# EAGLE design ub (EAGLE 5.11)
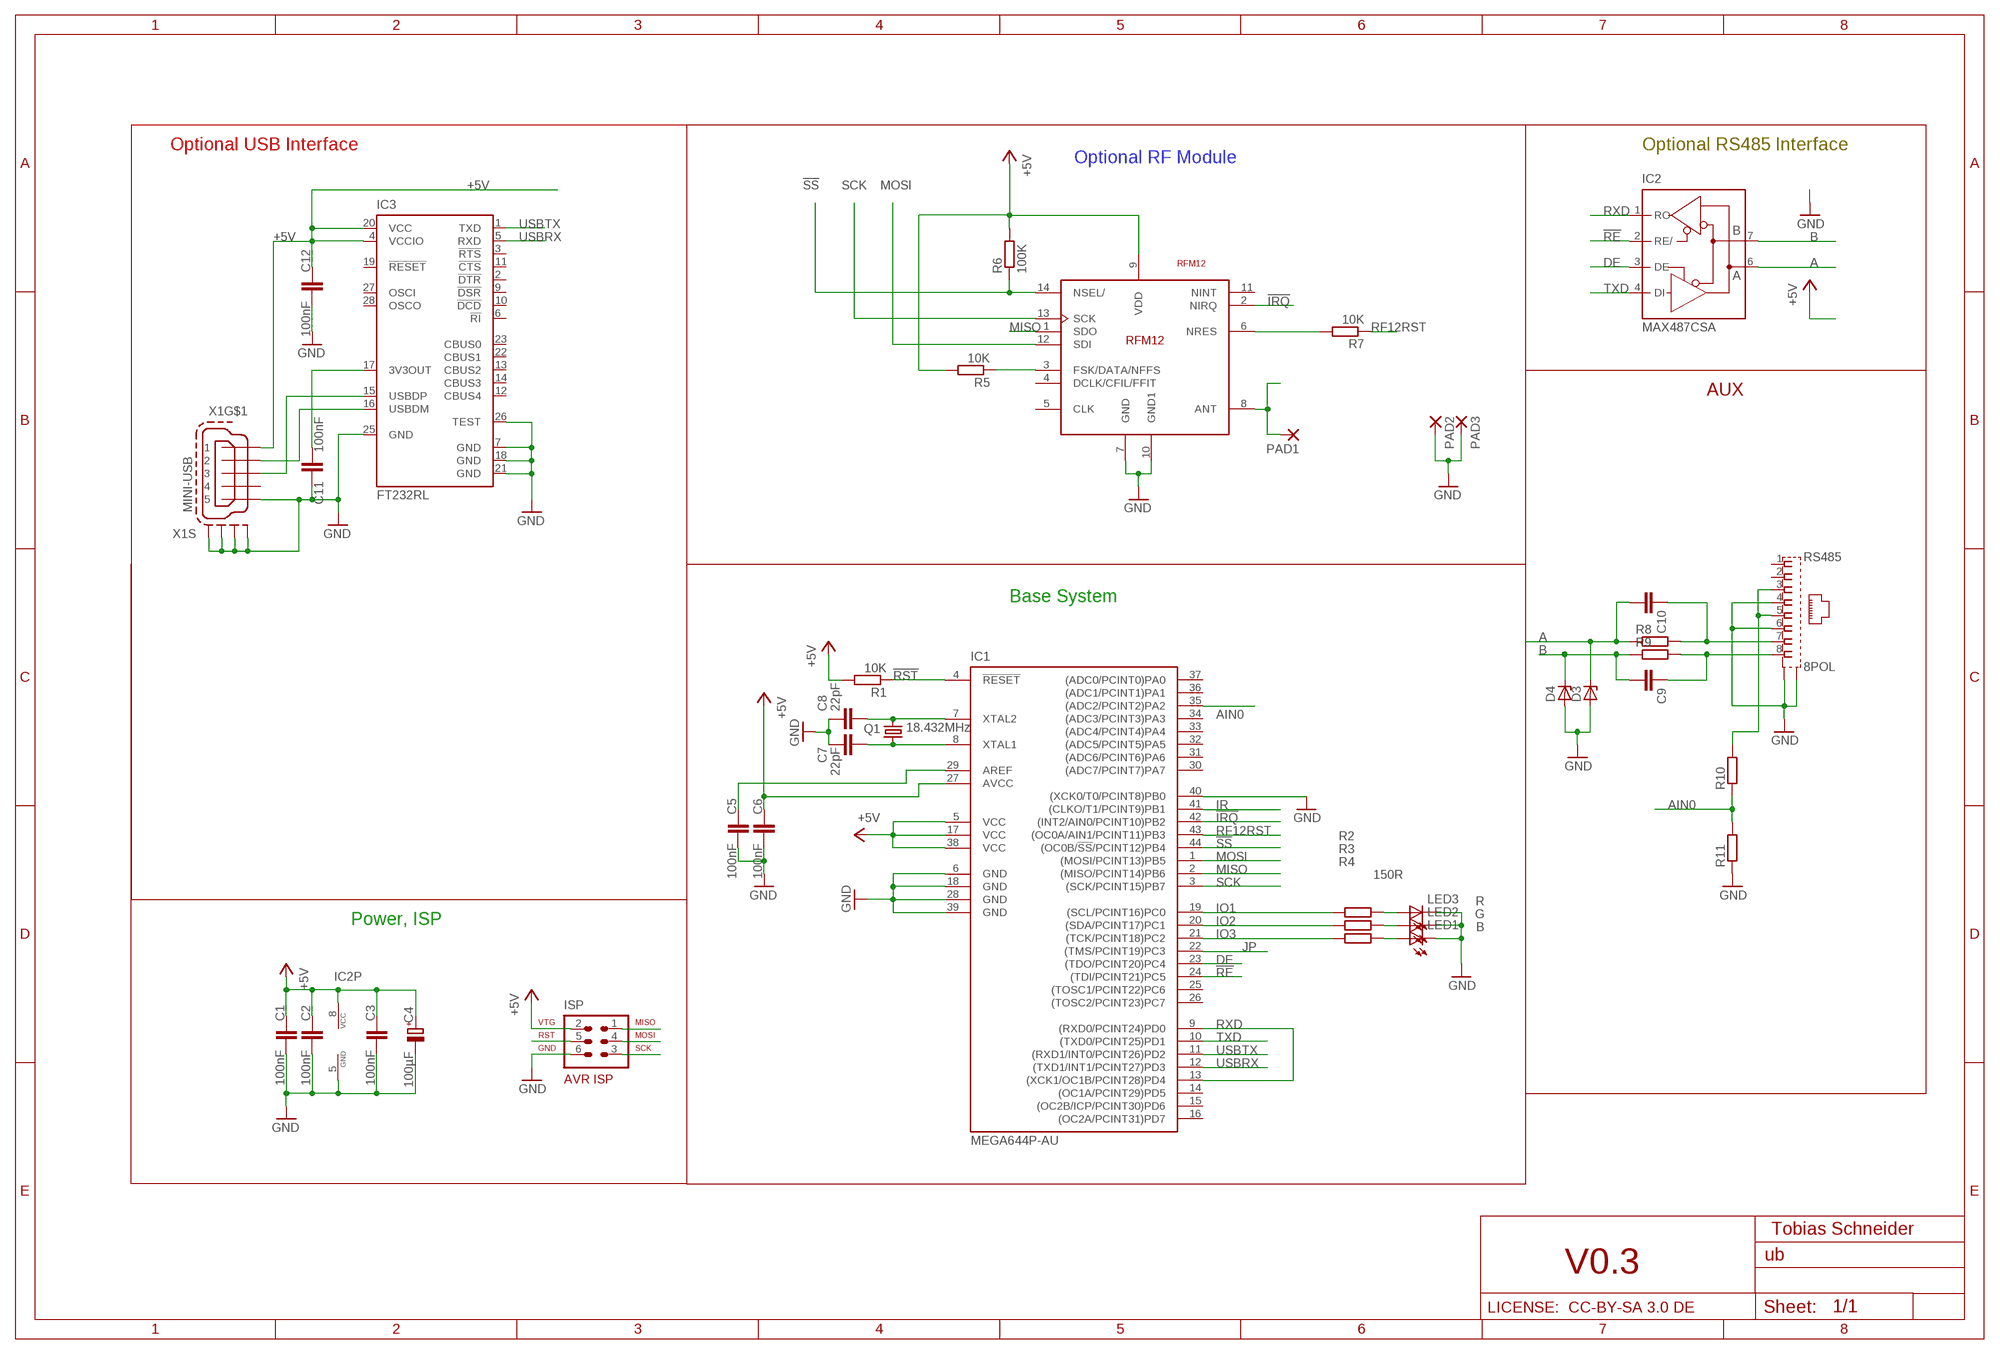
[diagram p0: schematic, sheet 1]

## Parts
C1  100nF  C-EUC0805K  [C0805K]
C2  100nF  C-EUC0805K  [C0805K]
C3  100nF  C-EUC0805K  [C0805K]
C4  100µF  CPOL-EUE2.5-6  [E2,5-6]
C5  100nF  C-EUC0805K  [C0805K]
C6  100nF  C-EUC0805K  [C0805K]
C7  22pF  C-EUC0805K  [C0805K]
C8  22pF  C-EUC0805K  [C0805K]
C9  C-EUC0805K  [C0805K]
C10  C-EUC0805K  [C0805K]
C11  100nF  C-EUC0805K  [C0805K]
C12  100nF  C-EUC0805K  [C0805K]
D3  ZENER-DIODESOD80C  [SOD80C]
D4  ZENER-DIODESOD80C  [SOD80C]
IC1  MEGA644P-AU  MEGA164P/324P/644P-AU  [TQFP44]
IC2  MAX487CSA  MAX481CSA  [SO08]
IC3  FT232RL  [SSOP28]
ISP  AVR-ISP-6  [AVR-ISP-6]
LED1  B  LEDCHIP-LED0805  [CHIP-LED0805]
LED2  G  LEDCHIP-LED0805  [CHIP-LED0805]
LED3  R  LEDCHIP-LED0805  [CHIP-LED0805]
PAD1  SMD2  [SMD1,27-2,54]
PAD2  SMD2  [SMD1,27-2,54]
PAD3  SMD2  [SMD1,27-2,54]
Q1  18.432MHz  CRYTALHC49UP  [HC49UP@1]
R1  10K  R-EU_M0805  [M0805]
R2  150R  R-EU_R0805  [R0805]
R3  150R  R-EU_R0805  [R0805]
R4  150R  R-EU_R0805  [R0805]
R5  10K  R-EU_M0805  [M0805]
R6  100K  R-EU_M0805  [M0805]
R7  10K  R-EU_M0805  [M0805]
R8  R-EU_R0805  [R0805]
R9  R-EU_R0805  [R0805]
R10  R-EU_R0805  [R0805]
R11  R-EU_R0805  [R0805]
RFM12  RFM12  FRM12  [RFM12]
RS485  8POL  [8POL]
X1  MINI-USB  MINI-USB-SCHIELD-32005-201  [32005-201]

## Nets
!IRQ: IC1.42((INT2/AIN0/PCINT10)PB2) RFM12.2(NIRQ)
!RE: IC1.24((TDI/PCINT21)PC5) IC2.2(RE/)
!RST: IC1.4(!RESET) ISP.5 R1.1
!SS: IC1.44((OC0B/!SS!/PCINT12)PB4) R6.1 RFM12.14(NSEL/)
+5V: C1.1 C2.1 C3.1 C4.+ C6.1 C12.1 IC1.5(VCC) IC1.17(VCC) IC1.27(AVCC) IC1.38(VCC) IC2.8(VCC) IC3.4(VCCIO) IC3.20(VCC) ISP.2 R1.2 R5.2 R6.2 RFM12.9(VDD) X1.1
A: C10.2 D3.C IC2.6(A) R8.1
AIN0: IC1.35((ADC2/PCINT2)PA2) R10.1 R11.2
B: C9.2 D4.C IC2.7(B) R9.1
DE: IC1.23((TDO/PCINT20)PC4) IC2.3(DE)
GND: C1.2 C2.2 C3.2 C4.- C5.2 C6.2 C7.1 C8.1 C11.1 C12.2 D3.A D4.A IC1.6(GND) IC1.18(GND) IC1.28(GND) IC1.39(GND) IC1.40((XCK0/T0/PCINT8)PB0) IC2.5(GND) IC3.7(GND) IC3.18(GND) IC3.21(GND) IC3.25(GND) IC3.26(TEST) ISP.6 LED1.C LED2.C LED3.C PAD2.1(P) PAD3.1(P) R11.1 RFM12.7(GND) RFM12.10(GND1) RS485.4 RS485.6 RS485.S1 RS485.S2 X1.5 X1.M1(S:S1) X1.M2(S:S2) X1.M3(S:S3) X1.M4(S:S4)
IO1: IC1.19((SCL/PCINT16)PC0) R2.2
IO2: IC1.20((SDA/PCINT17)PC1) R3.2
IO3: IC1.21((TCK/PCINT18)PC2) R4.2
IR: IC1.41((CLKO/T1/PCINT9)PB1)
JP: IC1.22((TMS/PCINT19)PC3)
MISO: IC1.2((MISO/PCINT14)PB6) ISP.1 RFM12.1(SDO)
MOSI: IC1.1((MOSI/PCINT13)PB5) ISP.4 RFM12.12(SDI)
N$3: C9.1 R9.2 RS485.8
N$10: IC3.16(USBDM) X1.2
N$11: R5.1 RFM12.3(FSK/DATA/NFFS)
N$12: R7.2 RFM12.6(NRES)
N$13: PAD1.1(P) RFM12.8(ANT)
N$15: C10.1 R8.2 RS485.7
N$16: IC3.15(USBDP) X1.3
N$20: C11.2 IC3.17(3V3OUT)
N$21: LED1.A R4.1
N$22: LED2.A R3.1
N$23: LED3.A R2.1
N$29: C5.1 IC1.29(AREF)
RF12RST: IC1.43((OC0A/AIN1/PCINT11)PB3) R7.1
RXD: IC1.9((RXD0/PCINT24)PD0) IC1.13((XCK1/OC1B/PCINT28)PD4) IC2.1(RO)
SCK: IC1.3((SCK/PCINT15)PB7) ISP.3 RFM12.13(SCK)
TXD: IC1.10((TXD0/PCINT25)PD1) IC2.4(DI)
USBRX: IC1.12((TXD1/INT1/PCINT27)PD3) IC3.5(RXD)
USBTX: IC1.11((RXD1/INT0/PCINT26)PD2) IC3.1(TXD)
VIN: R10.2 RS485.3 RS485.5
XTAL1: C8.2 IC1.7(XTAL2) Q1.2
XTAL2: C7.2 IC1.8(XTAL1) Q1.1
Unconnected: IC1.14((OC1A/PCINT29)PD5) IC1.15((OC2B/ICP/PCINT30)PD6) IC1.16((OC2A/PCINT31)PD7) IC1.25((TOSC1/PCINT22)PC6) IC1.26((TOSC2/PCINT23)PC7) IC1.30((ADC7/PCINT7)PA7) IC1.31((ADC6/PCINT6)PA6) IC1.32((ADC5/PCINT5)PA5) IC1.33((ADC4/PCINT4)PA4) IC1.34((ADC3/PCINT3)PA3) IC1.36((ADC1/PCINT1)PA1) IC1.37((ADC0/PCINT0)PA0) IC3.2(!DTR) IC3.3(!RTS) IC3.6(!RI) IC3.9(!DSR) IC3.10(!DCD) IC3.11(!CTS) IC3.12(CBUS4) IC3.13(CBUS2) IC3.14(CBUS3) IC3.19(!RESET) IC3.22(CBUS1) IC3.23(CBUS0) IC3.27(OSCI) IC3.28(OSCO) RFM12.4(DCLK/CFIL/FFIT) RFM12.5(CLK) RFM12.11(NINT) RS485.1 RS485.2 X1.4

## Notes on the sheet
- Optional USB Interface | Optional RS485 Interface
- Optional RF Module
- AUX
- Base System
- Power, ISP
- Tobias Schneider
- V0.3
- LICENSE:  CC-BY-SA 3.0 DE

## Library data of the parts
C1-C3 C5-C12 = rcl:C-EU: CAPACITOR, European symbol
C4 = rcl:CPOL-EU: POLARIZED CAPACITOR, European symbol
D3 D4 = diode:ZENER-DIODE: Z-Diode
IC1 = avr-5:MEGA164P/324P/644P-AU
IC2 = maxim:MAX481CSA: RS485 TRANSEIVER
IC3 = ftdichip:FT232R: Source: http://www.ftdichip.com/Documents/DataSheets/DS_FT232R_v104.pdf
ISP = atmel:AVR-ISP-6: AVR ISP-6 Serial Programming Header
LED1-LED3 = led:LED: LED OSRAM: - CHIPLED LG R971, LG N971, LY N971, LG Q971, LY Q971, LO R971, LY R971 LH N974, LH R974 LS Q976, LO Q976, LY Q976 LO Q996 - Hyper CHIPLED LW Q18S LB Q993, LB Q99A, LB R99A - SideLED LS A670, LO A670, LY A670, LG A670, LP A670 LB A673, LV A673, LT A673, LW A673 LH A674 LY A675 LS A676, LA A676, LO A676, LY A676, LW A676 LS A679, LY A679, LG A679 - Hyper Micro SIDELED® LS Y876, LA Y876, LO Y876, LY Y876 LT Y87S - SmartLED LW L88C, LW L88S LB L89C, LB L89S, LG L890 LS L89K, LO L89K, LY L89K LS L896, LA L896, LO L896, LY L896 - TOPLED LS T670, LO T670, LY T670, LG T670, LP T670 LSG T670, LSP T670, LSY T670, LOP T670, LYG T670 LG T671, LOG T671, LSG T671 LB T673, LV T673, LT T673, LW T673 LH T674 LS T676, LA T676, LO T676, LY T676, LB T676, LH T676, LSB T676, LW T676 LB T67C, LV T67C, LT T67C, LS T67K, LO T67K, LY T67K, LW E67C LS E67B, LA E67B, LO E67B, LY E67B, LB E67C, LV E67C, LT E67C LW T67C LS T679, LY T679, LG T679 LS T770, LO T770, LY T770, LG T770, LP T770 LB T773, LV T773, LT T773, LW T773 LH T774 LS E675, LA E675, LY E675, LS T675 LS T776, LA T776, LO T776, LY T776, LB T776 LHGB T686 LT T68C, LB T68C - Hyper Mini TOPLED® LB M676 - Mini TOPLED Santana® LG M470 LS M47K, LO M47K, LY M47K Source: http://www.osram.convergy.de LUXEON: - LUMILED® LXK2-PW12-R00, LXK2-PW12-S00, LXK2-PW14-U00, LXK2-PW14-V00 LXK2-PM12-R00, LXK2-PM12-S00, LXK2-PM14-U00 LXK2-PE12-Q00, LXK2-PE12-R00, LXK2-PE12-S00, LXK2-PE14-T00, LXK2-PE14-U00 LXK2-PB12-K00, LXK2-PB12-L00, LXK2-PB12-M00, LXK2-PB14-N00, LXK2-PB14-P00, LXK2-PB14-Q00 LXK2-PR12-L00, LXK2-PR12-M00, LXK2-PR14-Q00, LXK2-PR14-R00 LXK2-PD12-Q00, LXK2-PD12-R00, LXK2-PD12-S00 LXK2-PH12-R00, LXK2-PH12-S00 LXK2-PL12-P00, LXK2-PL12-Q00, LXK2-PL12-R00 Source: www.luxeon.com KINGBRIGHT: KA-3528ASYC Source: www.kingbright.com
PAD1-PAD3 = wirepad:SMD2: SMD PAD
Q1 = crystal:CRYTAL: CRYSTAL
R1-R11 = rcl:R-EU_: RESISTOR, European symbol
RFM12 = RFM12:FRM12
RS485 = con-amp:8POL
X1 = con-cypressindustries:MINI-USB-SCHIELD-: MINI USB-B Conector Source: www.cypressindustries.com

## Board
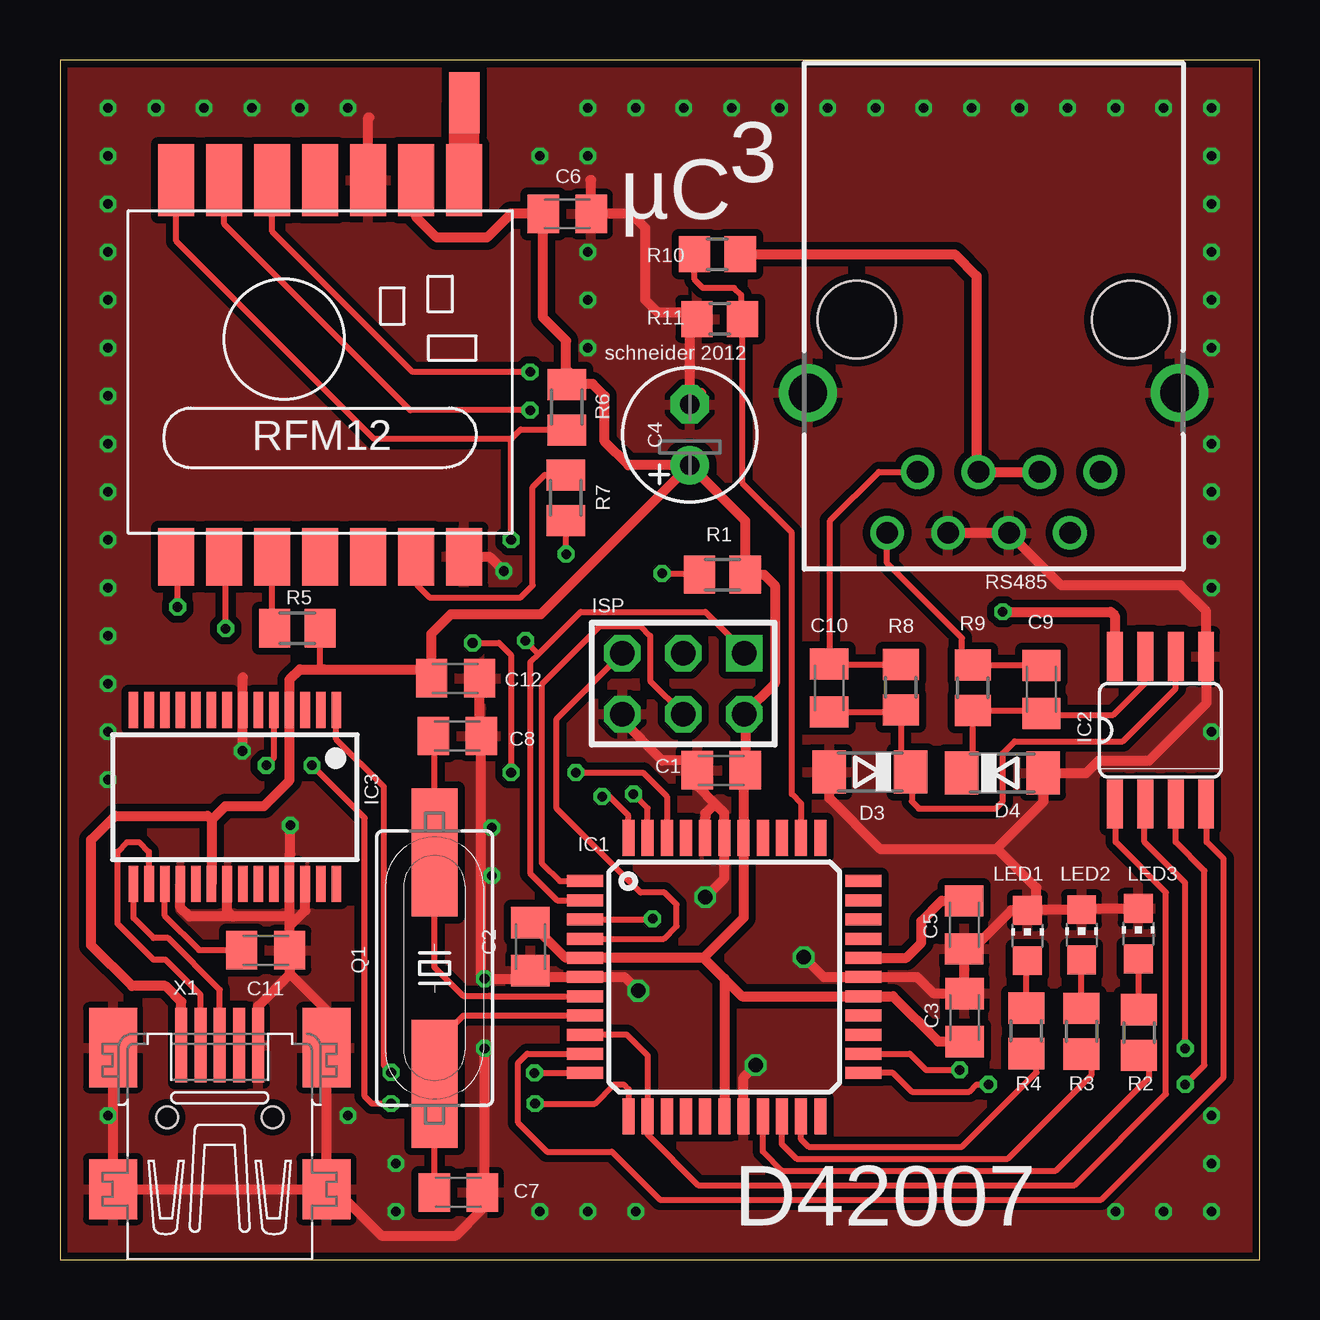
[diagram p1: board, top side]
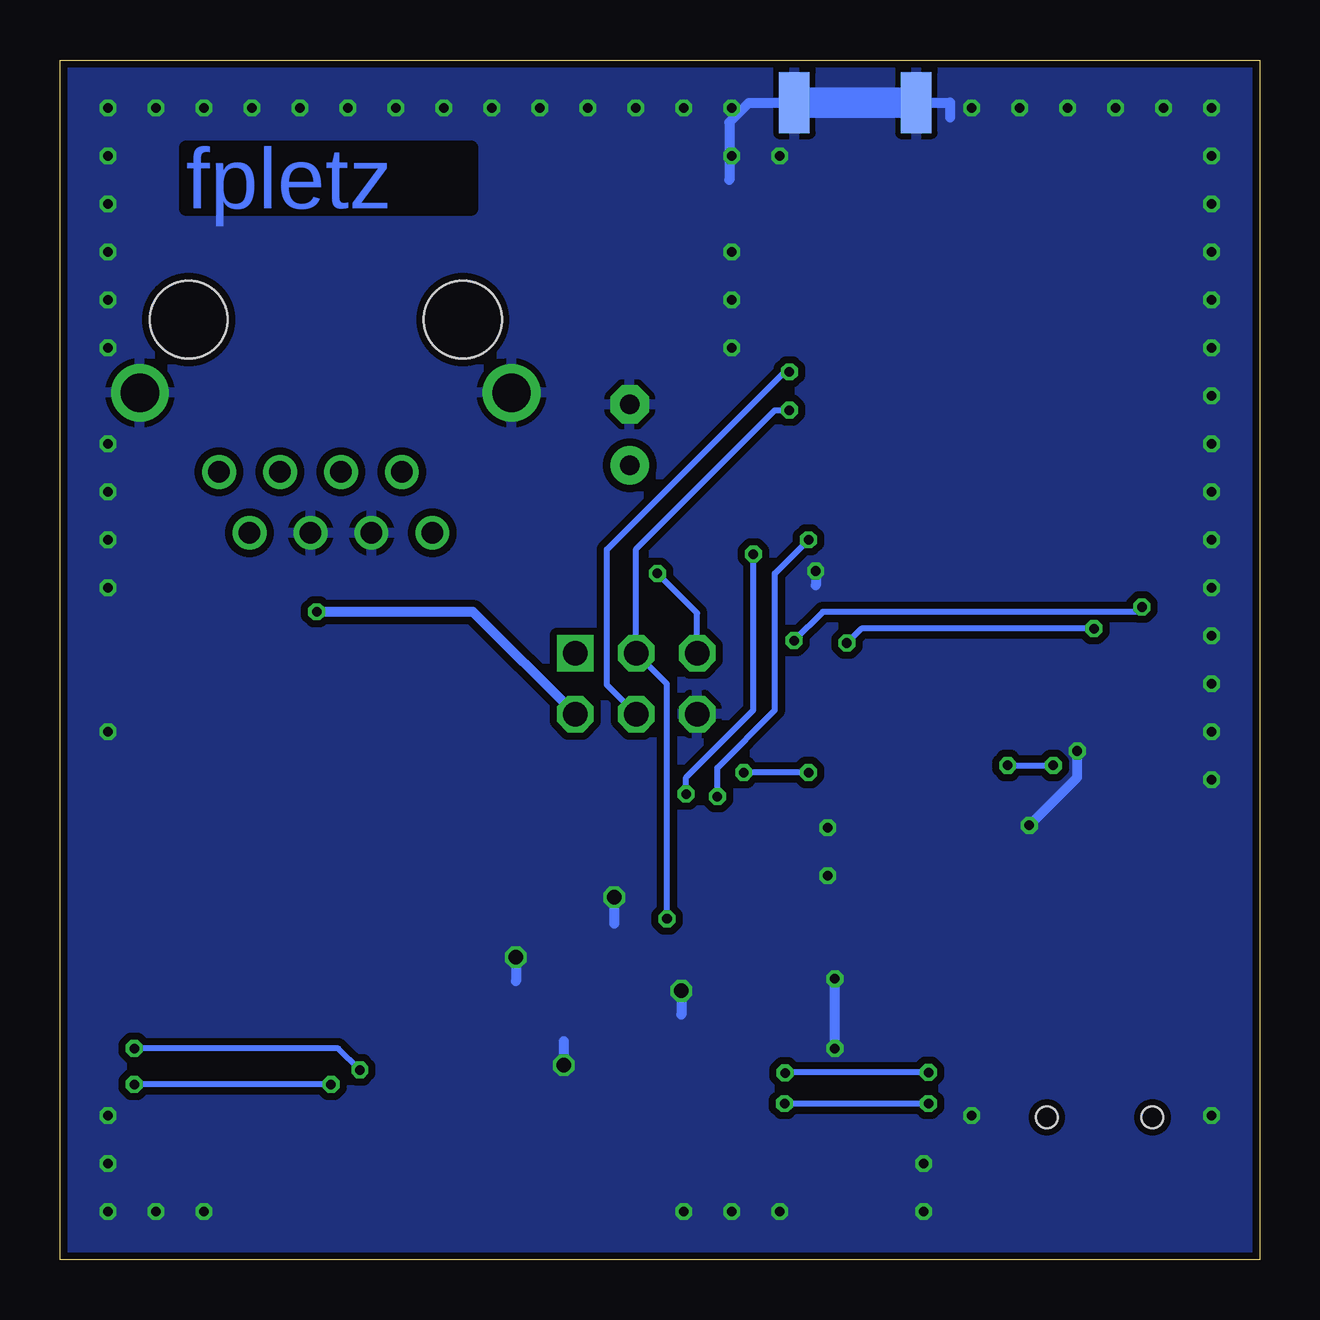
[diagram p2: board, bottom side, seen from below]

Size 50 x 50 mm. Coordinates in mm from the lower left corner, seen from the top.
Outline: 0,0 50,0 50,50 0,50 0,0
Copper layers (1*16): Top 0.035mm / dielectric 1.5mm / Bottom 0.035mm
Design rules "Fusion_eagle_rule_v1.1 *": minimum track width 6mil, minimum drill 12mil, track to track 6mil, track to pad 6mil, pad to pad 6mil, via to via 6mil, smd to smd 0mil, copper to edge 10mil, drill to drill 10mil, minimum pad ring 10mil, minimum via ring 6mil, stop-mask expansion 2mil, vias tented up to drill 100mil, thermal gap 10mil
tRestrict: area 9.9,14.9 to 9.9,16.5; area 27.2,16.9 to 27.2,18.3; area 27.2,16.9 to 27.4,18.3

### Footprints (pad centres in the part's own frame; a part is rotated, then mirrored left to right if it is on the bottom)
C0805K = smd 1.3 x 1.6: 1 -1,0; 2 1,0
E2,5-6 = drill 0.813 pad 1.6 round: + -1.27,0 | drill 0.813 pad 1.6 octagon: - 1.27,0
SOD80C = smd 1.4 x 1.8: A 1.7,0; C -1.7,0
TQFP44 = smd 1.5 x 0.5: 1 -5.8,4; 2 -5.8,3.2; 3 -5.8,2.4; 4 -5.8,1.6; 5 -5.8,0.8; 6 -5.8,0; 7 -5.8,-0.8; 8 -5.8,-1.6; 9 -5.8,-2.4; 10 -5.8,-3.2; 11 -5.8,-4; 23 5.8,-4; 24 5.8,-3.2; 25 5.8,-2.4; 26 5.8,-1.6; 27 5.8,-0.8; 28 5.8,0; 29 5.8,0.8; 30 5.8,1.6; 31 5.8,2.4; 32 5.8,3.2; 33 5.8,4 | smd 0.5 x 1.5: 12 -4,-5.8; 13 -3.2,-5.8; 14 -2.4,-5.8; 15 -1.6,-5.8; 16 -0.8,-5.8; 17 0,-5.8; 18 0.8,-5.8; 19 1.6,-5.8; 20 2.4,-5.8; 21 3.2,-5.8; 22 4,-5.8; 34 4,5.8; 35 3.2,5.8; 36 2.4,5.8; 37 1.6,5.8; 38 0.8,5.8; 39 0,5.8; 40 -0.8,5.8; 41 -1.6,5.8; 42 -2.4,5.8; 43 -3.2,5.8; 44 -4,5.8
SO08 = smd 0.66 x 2.032: 1 -1.905,-3.073; 2 -0.635,-3.073; 3 0.635,-3.073; 4 1.905,-3.073; 5 1.905,3.073; 6 0.635,3.073; 7 -0.635,3.073; 8 -1.905,3.073
SSOP28 = smd 0.4 x 1.5: 1 -4.225,-3.625; 2 -3.575,-3.625; 3 -2.925,-3.625; 4 -2.275,-3.625; 5 -1.625,-3.625; 6 -0.975,-3.625; 7 -0.325,-3.625; 8 0.325,-3.625; 9 0.975,-3.625; 10 1.625,-3.625; 11 2.275,-3.625; 12 2.925,-3.625; 13 3.575,-3.625; 14 4.225,-3.625; 15 4.225,3.625; 16 3.575,3.625; 17 2.925,3.625; 18 2.275,3.625; 19 1.625,3.625; 20 0.975,3.625; 21 0.325,3.625; 22 -0.325,3.625; 23 -0.975,3.625; 24 -1.625,3.625; 25 -2.275,3.625; 26 -2.925,3.625; 27 -3.575,3.625; 28 -4.225,3.625
AVR-ISP-6 = drill 1.016 square: 1 -2.54,-1.27 | drill 1.016 octagon: 2 -2.54,1.27; 3 0,-1.27; 4 0,1.27; 5 2.54,-1.27; 6 2.54,1.27
CHIP-LED0805 = smd 1.2 x 1.2: A 0,-1.05; C 0,1.05
SMD1,27-2,54 = smd 1.27 x 2.54: 1 0,0
HC49UP@1 = smd 5.334 x 1.93: 1 -4.826,0; 2 4.826,0
M0805 = smd 1.3 x 1.6: 1 -0.95,0; 2 0.95,0
R0805 = smd 1.3 x 1.5: 1 -0.95,0; 2 0.95,0
RFM12 = smd 1.5 x 2.4: 1 -5,-9.7; 2 -3,-9.7; 3 -1,-9.7; 4 1,-9.7; 5 3,-9.7; 6 5,-9.7; 7 7,-9.7 | smd 1.5 x 3: 8 7,6; 9 5,6; 10 3,6; 11 1,6; 12 -1,6; 13 -3,6; 14 -5,6
8POL = drill 0.9 round: 1 -4.445,6.35; 2 -3.175,8.89; 3 -1.905,6.35; 4 -0.635,8.89; 5 0.635,6.35; 6 1.905,8.89; 7 3.175,6.35; 8 4.445,8.89 | drill 1.6 round: S1 -7.745,3.05; S2 7.745,3.05 | hole 3.25: -5.715,0; 5.715,0
32005-201 = smd 3.1 x 0.5: 1 3,1.6; 2 3,0.8; 3 3,0; 4 3,-0.8; 5 3,-1.6 | smd 2.5 x 2: M1 -3,-4.45; M2 -3,4.45 | smd 3.3 x 2: M3 2.9,4.45; M4 2.9,-4.45 | hole 0.9: 0,2.2; 0,-2.2

### Placement (x,y rotation side)
C1  27.57,20.39 180 top
C2  19.61,13.04 270 top
C3  37.71,10.09 90 top
C4  26.25,34.37 90 top
C5  37.69,13.95 270 top
C6  21.14,43.59 0 top
C7  16.61,2.8 180 top
C8  16.56,21.82 180 top
C9  40.91,23.76 270 top
C10  32.07,23.82 270 top
C11  8.58,12.89 180 top
C12  16.49,24.22 0 top
D3  33.76,20.32 180 top
D4  39.28,20.28 0 top
IC1  27.69,11.78 0 top
IC2  45.87,22.06 0 top
IC3  7.29,19.27 180 top
ISP  25.98,24.01 180 top
LED1  40.33,13.51 0 top
LED2  42.59,13.54 0 top
LED3  44.94,13.58 0 top
PAD1  16.85,48.22 0 top
PAD2  14.31,48.22 0 bottom
PAD3  19.39,48.22 180 bottom
Q1  15.61,12.15 90 top
R1  27.61,28.55 0 top
R2  44.98,9.46 270 top
R3  42.57,9.51 270 top
R4  40.27,9.53 270 top
R5  9.9,26.31 0 top
R6  21.13,35.52 90 top
R7  21.08,31.75 90 top
R8  35.05,23.86 90 top
R9  38.05,23.84 90 top
R10  27.4,41.9 0 top
R11  27.5,39.2 0 top
RFM12  9.85,39 0 top
RS485  38.92,39.18 180 top
X1  6.66,5.93 90 top

### Tracks (layer width: path | path; a pad name or v marks a point on that pad's centre or on a via)
!IRQ  (via drill 0.4)
  Top 0.254: RFM12.2 6.9,29.25 v6.9,26.3 | IC1.42 25.3,19.3 24.3,20.3 v21.5,20.3 | v17.2,25.7 18.3,25.7 18.8,25.2 v18.8,20.3
  Bottom 0.254: v6.9,26.3 16.6,26.3 v17.2,25.7 | v18.8,20.3 v21.5,20.3
!RE  (via drill 0.4)
  Top 0.254: IC2.2 45.2,18.95 45.2,17.4 46.9,15.7 v46.9,8.8 | IC1.24 35.42,8.57 36.1,7.9 v37.5,7.9
  Bottom 0.254: v37.5,7.9 38.4,8.8 v46.9,8.8
!RST  (via drill 0.4)
  Top 0.254: IC1.4 25.18,13.38 25.7,13.9 25.7,14.8 25.2,15.3 24.2,15.3 23.1,16.4 22.7,16.8 20.7,18.8 20.7,22.54 ISP.5 | v25.1,28.6 26.61,28.6 R1.1
  Bottom 0.254: ISP.5 23.44,26.94 v25.1,28.6
!SS  (via drill 0.4)
  Top 0.254: 4.88,45.02 RFM12.14 4.85,42.45 13.1,34.2 18.8,34.2 | IC1.44 23.69,18.51 22.9,19.3 v22.6,19.3 | v18.8,30 18.8,34.2 | 18.8,34.2 19.2,34.6 21.11,34.6 R6.1
  Bottom 0.254: v18.8,30 20.2,28.6 20.2,22.9 22.6,20.5 v22.6,19.3
+5V  (via drill 0.4)
  Top 0.254: R5.2 10.85,24.75 11,24.6 | RFM12.9 14.8,45.05
  Top 0.406: C3.1 36.61,9.09 34.73,10.97 IC1.27 28.43,10.97 27.7,11.7 | IC1.17 27.7,11.7 | 26.82,12.57 IC1.5 21.07,12.57 C2.1 | 26.82,12.57 27.7,11.7 | 26.82,12.57 28.49,14.24 IC1.38 28.49,20.32 C1.1 28.57,22.69 ISP.2 29.8,24.02 29.8,28.1 29.35,28.55 R1.2 28.56,30.79 C4.+ | X1.1 5.06,10.74 4.4,11.4 3,11.4 1.3,13.1 1.3,17.5 2.3,18.5 6.14,18.5 6.32,18.32 | 6.32,18.32 IC3.20 | 6.32,18.32 6.9,18.9 8.5,18.9 9.57,19.97 IC3.4 9.57,24.17 10,24.6 11,24.6 15.11,24.6 C12.1 15.49,26.09 16.3,26.9 20.05,26.9 C4.+ | RFM12.9 14.85,43.45 15.7,42.6 17.8,42.6 18.8,43.6 C6.1 20.14,39.26 21.1,38.3 21.1,37.1 R6.2 | C4.+ 23.7,33.1 22.7,34.1 22.7,36 22.2,36.5 21.16,36.5 R6.2 | R6.2 21.2,37 | IC2.8 43.96,26.84 43.8,27 v39.3,27
  Bottom 0.406: v39.3,27 32.78,27 ISP.2
A
  Top 0.254: C10.2 35.37,22.82 R8.1 35.05,20.73 D3.C | D3.C 35.45,20.34 | IC2.6 46.5,23.8 44.3,21.6 39.8,21.6 39.3,21.1 39.3,19.1 39,18.8 35.8,18.8 35.5,19.1 35.5,20.29 D3.C
AIN0
  Top 0.254: R10.1 26.45,40.85 26.8,40.5 28.1,40.5 28.4,40.2 28.4,39.25 R11.2 28.45,32.35 30.5,30.3 30.5,19.4 30.9,19 IC1.35
B
  Top 0.254: 37.65,20.35 D4.C 38.05,20.75 R9.1 40.78,22.89 C9.2 40.97,22.7 43.9,22.7 45.2,24 45.2,25.1 IC2.7
DE  (via drill 0.4)
  Top 0.254: IC1.23 34.73,7.78 35.5,7 37.9,7 38.2,7.3 v38.7,7.3 | IC2.3 46.5,17.4 47.7,16.2 47.7,8.1 v46.9,7.3
  Bottom 0.254: v38.7,7.3 v46.9,7.3
GND  (via drill 0.4, 0.6)
  Top 0.254: C11.1 | IC3.25 9.6,15.68 | IC3.18 5,15.63
  Top 0.406: RS485.6 RS485.4 41.75,28.1 46.7,28.1 47.77,27.03 IC2.5 47.8,25.11 47.8,23.2 45.4,20.8 43.3,20.8 42.78,20.28 D4.A 41,20.26 41,19.1 39,17.1 | LED3.C 43.03,14.63 LED2.C 40.76,14.59 LED1.C | 37.71,12.93 C5.2 | 37.71,12.93 C3.2 37.7,11.1 36.4,11.1 35.73,11.78 IC1.28 31.82,11.78 v31,12.6 | LED1.C 40.67,14.5 | IC1.18 28.49,7.59 v29,8.1 | v24.1,11.2 23.52,11.78 IC1.6 19.88,11.78 C2.2 | v26.9,15.1 27.69,15.89 IC1.39 27.69,18.61 27.3,19 | 27.3,19 26.9,18.6 26.9,18.4 26.89,18.39 IC1.40 | 27.3,19 26.57,19.73 C1.2 26.16,20.8 25.1,20.8 23.44,22.46 ISP.6 23.5,22.68 | X1.5 8.26,10.56 9.6,11.9 | 9.6,11.9 9.6,12.87 C11.1 | X1.M1 X1.M4 11.11,10.39 9.6,11.9 | X1.M3 X1.M2 X1.M1 | C11.1 9.57,13.9 | 9.57,13.9 9.57,14.2 | 9.57,14.2 IC3.25 9.57,16.87 9.6,16.9 v9.6,18.1 | IC3.26 10.22,14.55 9.57,13.9 | IC3.21 6.97,14.53 7.2,14.3 | 7.2,14.3 9.47,14.3 9.57,14.2 | IC3.18 5.02,14.68 5.4,14.3 7.2,14.3 | v7.6,21.2 7.62,21.2 IC3.7 7.62,24.28 | X1.M1 11.47,2.93 13.4,1 16.5,1 17.6,2.1 C7.1 17.7,2.89 v17.7,8.8 | C12.2 17.48,21.9 C8.1 17.56,11.84 v17.7,11.7 19.27,11.7 C2.2 | C2.2 19.57,12 | 37.71,12.93 38.03,12.93 39.66,14.55 LED1.C | LED1.C 40.68,14.6 | 32.06,20.14 D3.A 32.06,19.24 34.2,17.1 39,17.1 | 39,17.1 39.1,17.1 40.7,15.5 40.7,14.58 LED1.C | 26.25,39.48 C4.- 26.73,36.13 | RFM12.7 17.9,29.3 v18.5,28.7 | 26.25,39.48 26.27,39.48 R11.1 | RFM12.10 12.85,47.6 12.9,47.6 | 22.1,45 22.14,45 C6.2 22.16,43.6 23.8,43.6 24.4,43 24.4,40 24.92,39.48 26.25,39.48
  Bottom 0.406: v29,8.1 29,9.1 | v31,12.6 31,11.6 | v24.1,11.2 24.1,10.2 | v26.9,15.1 26.9,14 | v9.6,18.1 7.6,20.1 v7.6,21.2 | v17.7,8.8 v17.7,11.7 | 14.29,48.2 PAD2.1 12.9,48.22 12.9,47.6 | v18.5,28.7 18.5,28.1 | 22.1,45 22.1,47.4 21.3,48.2 19.41,48.2 PAD3.1
  Bottom 1.27: PAD2.1 PAD3.1
  other vias: 4,48 6,48 8,48 10,48 12,48 22,48 24,48 26,48 28,48 30,48 32,48 34,48 36,48 38,48 40,48 42,48 44,48 46,48 48,48 2,48 2,46 2,44 2,42 2,40 2,38 2,36 2,34 2,32 2,30 2,28 2,26 2,24 2,22 2,20 2,6 14,2 20,2 22,2 24,2 46,2 48,2 48,4 48,6 44,2 48,28 48,22 48,30 48,32 48,34 48,38 48,40 48,42 48,44 48,46 22,46 20,46 22,42 22,40 22,38 14,4 12,6 18,18 18,16
  pour Bottom (isolate 0.305): -1.49,51.66 53.17,51.85 52.78,-1.14 -1.75,-1.45
  pour Top (isolate 0.305): -1.29,51.76 -1.34,-2.02 52.88,-0.43 52.66,51.95
IO1
  Top 0.254: R2.2 45.4,8.49 45.4,7.6 41.5,3.7 30.1,3.7 29.29,4.51 IC1.19
IO2
  Top 0.254: IC1.20 30.09,4.81 30.7,4.2 39.5,4.2 43,7.7 43,8.54 R3.2
IO3
  Top 0.254: IC1.21 30.89,5.01 31.2,4.7 37.6,4.7 40.7,7.8 40.7,8.55 R4.2
MISO  (via drill 0.4)
  Top 0.254: IC1.2 20.73,14.97 19.6,16.1 19.6,24.9 19.95,25.25 | 19.95,25.25 21.7,27 26.9,27 28.52,25.38 ISP.1 | RFM12.1 4.9,29.25 v4.9,27.2 | v19.4,25.8 19.95,25.25
  Bottom 0.254: v4.9,27.2 5.1,27 18.2,27 v19.4,25.8
MOSI  (via drill 0.4)
  Top 0.254: IC1.1 20.82,15.78 20.1,16.5 20.1,24 22.5,26.4 24.2,26.4 24.6,26 24.6,24.12 ISP.4 | RFM12.12 8.85,42.85 14.7,37 v19.6,37
  Bottom 0.254: ISP.4 27.2,23.96 27.2,29.6 19.8,37 v19.6,37
N$3
  Top 0.254: RS485.8 34.48,29.02 37.6,25.9 37.6,24.83 R9.2 40.88,24.79 C9.1
N$10
  Top 0.254: 3.7,15.63 IC3.16 3.7,15.83 3.7,17 3.3,17.4 2.8,17.4 2.4,17 2.4,14 3.9,12.5 4.4,12.5 5.86,11.04 X1.2
N$11
  Top 0.254: RFM12.3 8.85,26.6 R5.1
N$12
  Top 0.254: RFM12.6 14.9,29.25 14.9,28.1 15.4,27.6 19.2,27.6 19.7,28.1 19.7,32.2 20.2,32.7 R7.2
N$13
  Top 1.27: RFM12.8 PAD1.1
N$15
  Top 0.254: RS485.7 34.13,32.83 32.1,30.8 32.1,24.86 C10.1 32.08,24.81 R8.2
N$16
  Top 0.254: X1.3 6.66,11.24 4.5,13.4 3.9,13.4 3.07,14.23 IC3.15
N$20
  Top 0.254: IC3.17 4.37,14.33 5.8,12.9 7.57,12.9 C11.2
N$21
  Top 0.254: R4.1 40.27,12.4 LED1.A
N$22
  Top 0.254: R3.1 42.57,12.47 LED2.A
N$23
  Top 0.254: R2.1 44.98,12.5 LED3.A
N$29
  Top 0.406: C5.1 36.75,14.95 35.9,14.1 35.9,13.2 35.27,12.57 IC1.29
RF12RST  (via drill 0.4)
  Top 0.254: IC1.43 24.49,18.81 v23.9,19.4 | v21.1,29.4 21.1,30.78 R7.1
  Bottom 0.254: v21.1,29.4 21.1,22.9 23.9,20.1 v23.9,19.4
RXD
  Top 0.254: IC1.9 23.62,9.38 24.5,8.5 IC1.13 24.5,5.97 24.5,5.2 26.6,3.1 42.3,3.1 46.1,6.9 46.1,15.3 44,17.4 44,18.95 IC2.1
SCK  (via drill 0.4)
  Top 0.254: IC1.3 24.7,14.18 v24.7,14.2 | RFM12.13 6.85,43.15 9.25,40.75 9.4,40.6 14.6,35.4 v19.6,35.4
  Bottom 0.254: v24.7,14.2 24.7,24 ISP.3 25.98,29.62 20.2,35.4 v19.6,35.4
TXD
  Top 0.254: IC1.10 19.48,8.57 19.1,8.2 19.1,5.7 20.3,4.5 23,4.5 25,2.5 43.4,2.5 48.5,7.6 48.5,16.7 47.8,17.4 47.8,18.96 IC2.4
USBRX  (via drill 0.4)
  Top 0.254: IC3.5 8.92,20.92 v8.6,20.6 | 23.7,5.97 IC1.12 23.7,7.1 23.5,7.3 23.1,7.3 22.3,6.5 v19.8,6.5 | v10.5,20.6 12.7,18.4 12.7,6.8 13,6.5 v13.8,6.5
  Bottom 0.254: v10.5,20.6 v8.6,20.6 | v13.8,6.5 v19.8,6.5
USBTX  (via drill 0.4)
  Top 0.254: v19.77,7.78 IC1.11 | IC3.1 11.52,21.68 13.5,19.7 13.5,8.1 v13.8,7.8
  Bottom 0.254: v13.8,7.8 19.75,7.8 v19.77,7.78
VIN
  Top 0.406: RS485.3 RS485.5 38.2,32.92 38.2,41 37.3,41.9 R10.2
XTAL1
  Top 0.254: C8.2 15.61,21.82 Q1.2 15.61,12.19 16.8,11 17.9,11 17.93,10.97 IC1.7 21.89,10.9
XTAL2
  Top 0.254: C7.2 Q1.1 15.61,8.97 16.81,10.18 IC1.8

### Text on the board
Bottom: fpletz
tPlace: µC | 3 | schneider 2012 | D42007